# EAGLE design rgb_fb (EAGLE 6.5.0)
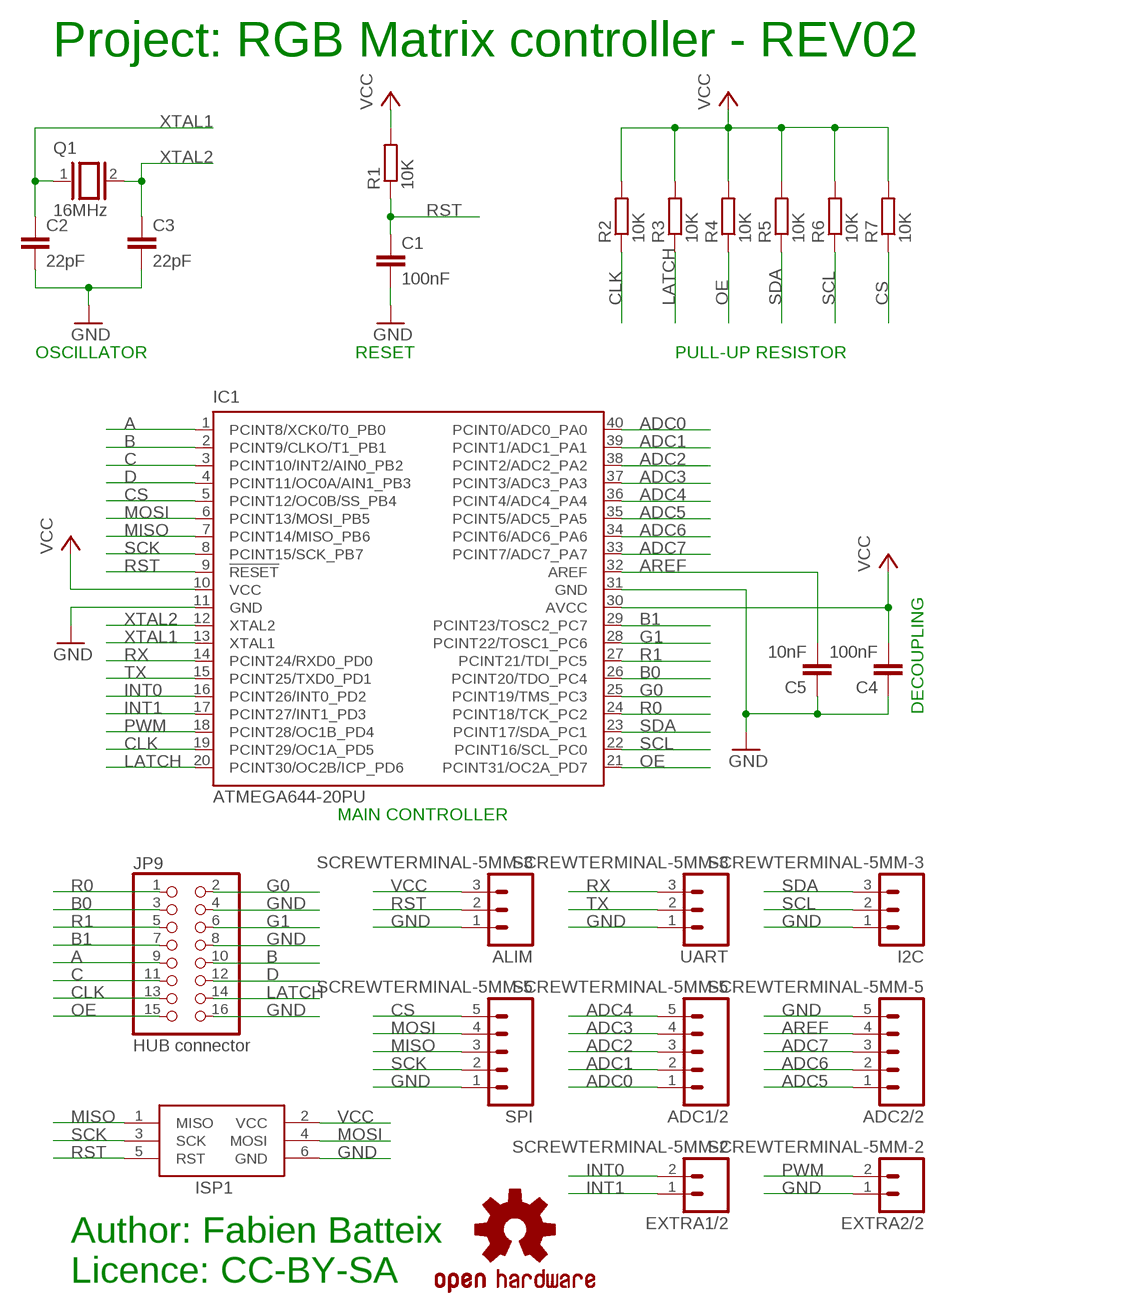
[diagram p0: schematic, sheet 1]

## Parts
ADC1/2  SCREWTERMINAL-5MM-5  [SCREWTERMINAL-5MM-5]
ADC2/2  SCREWTERMINAL-5MM-5  [SCREWTERMINAL-5MM-5]
ALIM  SCREWTERMINAL-5MM-3  [SCREWTERMINAL-5MM-3]
C1  100nF  C5/3.5  [C5B3.5]
C2  22pF  C5/3.5  [C5B3.5]
C3  22pF  C5/3.5  [C5B3.5]
C4  100nF  C5/3.5  [C5B3.5]
C5  10nF  C5/3.5  [C5B3.5]
EXTRA1/2  SCREWTERMINAL-5MM-2  [SCREWTERMINAL-5MM-2]
EXTRA2/2  SCREWTERMINAL-5MM-2  [SCREWTERMINAL-5MM-2]
I2C  SCREWTERMINAL-5MM-3  [SCREWTERMINAL-5MM-3]
IC1  ATMEGA644-20PU  [DIL40]
ISP1  AVRISP-6  [AVRISP]
JP9  HUB connector  PINHD-2X8  [2X08]
LOGO2  OSHW-LOGOL  [OSHW-LOGO-L]
Q1  16MHz  XTAL/S  [QS]
R1  10K  R-EU_0207/10  [0207/10]
R2  10K  R-EU_0207/10  [0207/10]
R3  10K  R-EU_0207/10  [0207/10]
R4  10K  R-EU_0207/10  [0207/10]
R5  10K  R-EU_0207/10  [0207/10]
R6  10K  R-EU_0207/10  [0207/10]
R7  10K  R-EU_0207/10  [0207/10]
SPI  SCREWTERMINAL-5MM-5  [SCREWTERMINAL-5MM-5]
UART  SCREWTERMINAL-5MM-3  [SCREWTERMINAL-5MM-3]

## Nets
A: IC1.1(PCINT8/XCK0/T0_PB0) JP9.9
ADC0: ADC1/2.1 IC1.40(PCINT0/ADC0_PA0)
ADC1: ADC1/2.2 IC1.39(PCINT1/ADC1_PA1)
ADC2: ADC1/2.3 IC1.38(PCINT2/ADC2_PA2)
ADC3: ADC1/2.4 IC1.37(PCINT3/ADC3_PA3)
ADC4: ADC1/2.5 IC1.36(PCINT4/ADC4_PA4)
ADC5: ADC2/2.1 IC1.35(PCINT5/ADC5_PA5)
ADC6: ADC2/2.2 IC1.34(PCINT6/ADC6_PA6)
ADC7: ADC2/2.3 IC1.33(PCINT7/ADC7_PA7)
AREF: ADC2/2.4 C5.2 IC1.32(AREF)
B: IC1.2(PCINT9/CLKO/T1_PB1) JP9.10
B0: IC1.26(PCINT20/TDO_PC4) JP9.3
B1: IC1.29(PCINT23/TOSC2_PC7) JP9.7
C: IC1.3(PCINT10/INT2/AIN0_PB2) JP9.11
CLK: IC1.19(PCINT29/OC1A_PD5) JP9.13 R2.1
CS: IC1.5(PCINT12/OC0B/SS_PB4) R7.1 SPI.5
D: IC1.4(PCINT11/OC0A/AIN1_PB3) JP9.12
G0: IC1.25(PCINT19/TMS_PC3) JP9.2
G1: IC1.28(PCINT22/TOSC1_PC6) JP9.6
GND: ADC2/2.5 ALIM.1 C1.2 C2.2 C3.2 C4.1 C5.1 EXTRA2/2.1 I2C.1 IC1.11(GND) IC1.31(GND) ISP1.6(GND) JP9.4 JP9.8 JP9.16 SPI.1 UART.1
INT0: EXTRA1/2.2 IC1.16(PCINT26/INT0_PD2)
INT1: EXTRA1/2.1 IC1.17(PCINT27/INT1_PD3)
LATCH: IC1.20(PCINT30/OC2B/ICP_PD6) JP9.14 R3.1
MISO: IC1.7(PCINT14/MISO_PB6) ISP1.1(MISO) SPI.3
MOSI: IC1.6(PCINT13/MOSI_PB5) ISP1.4(MOSI) SPI.4
OE: IC1.21(PCINT31/OC2A_PD7) JP9.15 R4.1
PWM: EXTRA2/2.2 IC1.18(PCINT28/OC1B_PD4)
R0: IC1.24(PCINT18/TCK_PC2) JP9.1
R1: IC1.27(PCINT21/TDI_PC5) JP9.5
RST: ALIM.2 C1.1 IC1.9(!RESET) ISP1.5(RST) R1.1
RX: IC1.14(PCINT24/RXD0_PD0) UART.3
SCK: IC1.8(PCINT15/SCK_PB7) ISP1.3(SCK) SPI.2
SCL: I2C.2 IC1.22(PCINT16/SCL_PC0) R6.1
SDA: I2C.3 IC1.23(PCINT17/SDA_PC1) R5.1
TX: IC1.15(PCINT25/TXD0_PD1) UART.2
VCC: ALIM.3 C4.2 IC1.10(VCC) IC1.30(AVCC) ISP1.2(VCC) R1.2 R2.2 R3.2 R4.2 R5.2 R6.2 R7.2
XTAL1: C2.1 IC1.13(XTAL1) Q1.1
XTAL2: C3.1 IC1.12(XTAL2) Q1.2

## Notes on the sheet
- Project: RGB Matrix controller - REV02
- OSCILLATOR | RESET | PULL-UP RESISTOR
- DECOUPLING
- MAIN CONTROLLER
- Author: Fabien Batteix
  Licence: CC-BY-SA

## Library data of the parts
ADC1/2 ADC2/2 SPI = skywodd:SCREWTERMINAL-5MM-5
ALIM I2C UART = skywodd:SCREWTERMINAL-5MM-3
C1-C5 = capacitor-wima:C: CAPACITOR naming: grid - package width
EXTRA1/2 EXTRA2/2 = skywodd:SCREWTERMINAL-5MM-2
IC1 = atmel:ATMEGA644-*PU: 8-bit Microcontroller with 64K Bytes In-System Programmable Flash Auto generated by make-symbol-device-package-bsdl.ulp Rev. 34 Source: http://www.atmel.com/dyn/resources/prod_documents/doc2593.pdf; MPN: ATMEGA644-20PU; OC_FARNELL: 1288340; OC_NEWARK: 23M5060
ISP1 = adafruit:AVRISP: AVR ISP HEADER Standard 6 pin header for AVR programming
JP9 = pinhead:PINHD-2X8: PIN HEADER
LOGO2 = SparkFun-Aesthetics:OSHW-LOGO: Open Source Hardware Logo This logo indicates the piece of hardware it is found on incorporates a OSHW license and/or adheres to the definition of open source hardware found here: http://freedomdefined.org/OSHW
Q1 = special:XTAL/S: CRYSTAL
R1-R7 = resistor:R-EU_: RESISTOR, European symbol

## Board
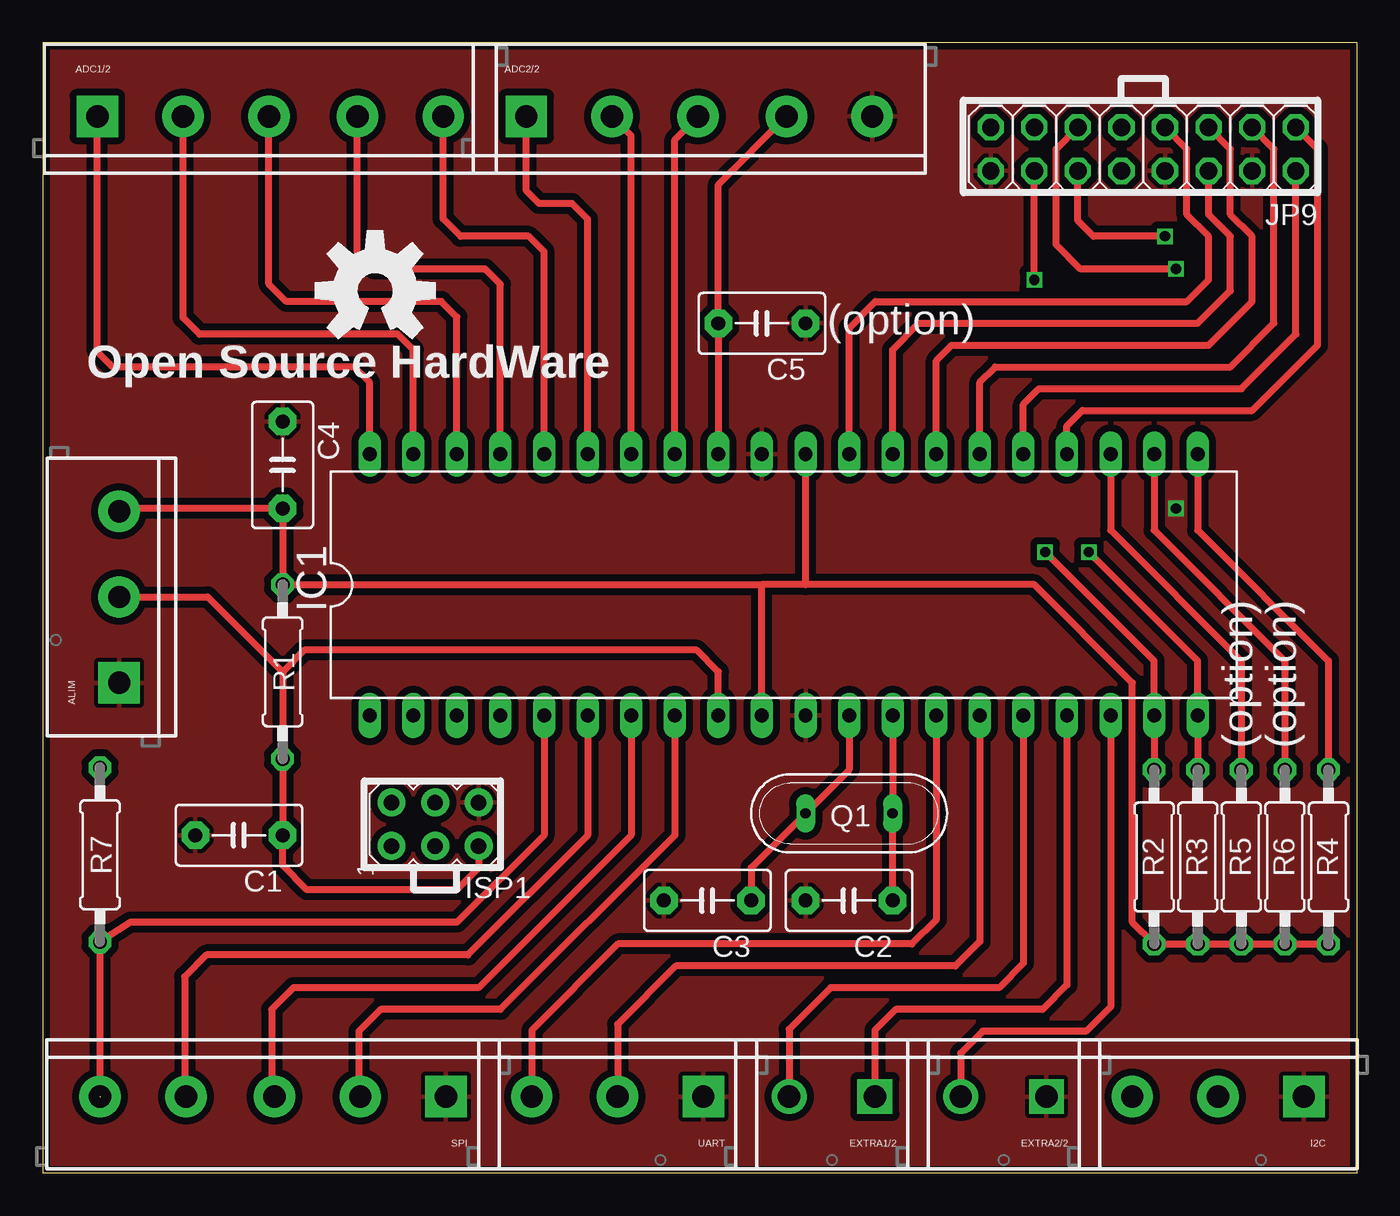
[diagram p1: board, top side]
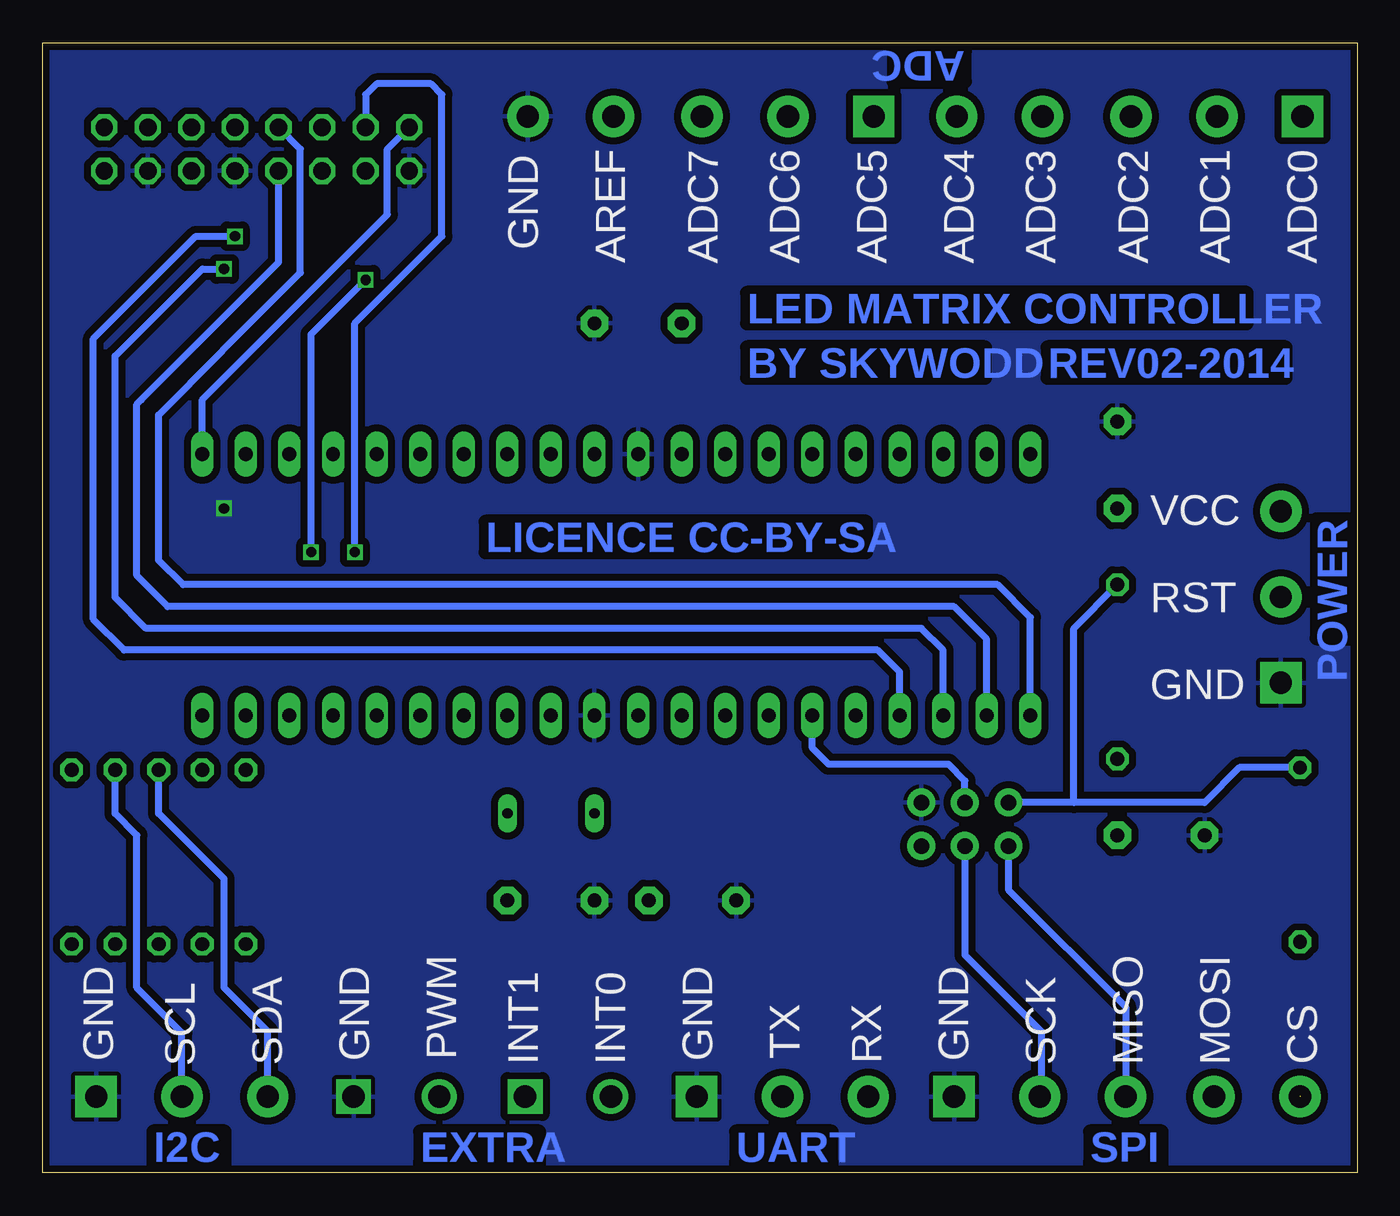
[diagram p2: board, bottom side, seen from below]

Size 76.6 x 65.89 mm. Coordinates in mm from the lower left corner, seen from the top.
Outline: 0,0 76.6,0 76.6,65.89 0,65.89 0,0
Copper layers (1*16): Top 0.035mm / dielectric 1.5mm / Bottom 0.035mm
Design rules "SeeedStudio_DRU_no_angle_2layer": minimum track width 6mil, minimum drill 12mil, track to track 6mil, track to pad 6mil, pad to pad 6mil, via to via 6mil, smd to smd 0mil, copper to edge 10mil, drill to drill 10mil, minimum pad ring 10mil, minimum via ring 6mil, stop-mask expansion 2mil, vias tented up to drill 25mil, thermal gap 10mil

### Footprints (pad centres in the part's own frame; a part is rotated, then mirrored left to right if it is on the bottom)
SCREWTERMINAL-5MM-5 = drill 1.3 pad 2.413 square: 1 -5.08,0 | drill 1.3 pad 2.413: 2 -0.08,0; 3 4.92,0; 4 10.08,0; 5 15.08,0
SCREWTERMINAL-5MM-3 = drill 1.3 pad 2.413 square: 1 0,0 | drill 1.3 pad 2.413: 2 5,0; 3 10,0
C5B3.5 = drill 0.813 pad 1.6 octagon: 1 -2.54,0; 2 2.54,0
SCREWTERMINAL-5MM-2 = drill 1.3 pad 2.032 square: 1 0,0 | drill 1.3 pad 2.032: 2 5,0
DIL40 = drill 0.813 long: 1 -24.13,-7.62; 2 -21.59,-7.62; 3 -19.05,-7.62; 4 -16.51,-7.62; 5 -13.97,-7.62; 6 -11.43,-7.62; 7 -8.89,-7.62; 8 -6.35,-7.62; 9 -3.81,-7.62; 10 -1.27,-7.62; 11 1.27,-7.62; 12 3.81,-7.62; 13 6.35,-7.62; 14 8.89,-7.62; 15 11.43,-7.62; 16 13.97,-7.62; 17 16.51,-7.62; 18 19.05,-7.62; 19 21.59,-7.62; 20 24.13,-7.62; 21 24.13,7.62; 22 21.59,7.62; 23 19.05,7.62; 24 16.51,7.62; 25 13.97,7.62; 26 11.43,7.62; 27 8.89,7.62; 28 6.35,7.62; 29 3.81,7.62; 30 1.27,7.62; 31 -1.27,7.62; 32 -3.81,7.62; 33 -6.35,7.62; 34 -8.89,7.62; 35 -11.43,7.62; 36 -13.97,7.62; 37 -16.51,7.62; 38 -19.05,7.62; 39 -21.59,7.62; 40 -24.13,7.62
AVRISP = drill 0.9 pad 1.626: 1 -1.27,2.54; 2 1.27,2.54; 3 -1.27,0; 4 1.27,0; 5 -1.27,-2.54; 6 1.27,-2.54
2X08 = drill 1.016 octagon: 1 -8.89,-1.27; 2 -8.89,1.27; 3 -6.35,-1.27; 4 -6.35,1.27; 5 -3.81,-1.27; 6 -3.81,1.27; 7 -1.27,-1.27; 8 -1.27,1.27; 9 1.27,-1.27; 10 1.27,1.27; 11 3.81,-1.27; 12 3.81,1.27; 13 6.35,-1.27; 14 6.35,1.27; 15 8.89,-1.27; 16 8.89,1.27
QS = drill 0.61 long: 1 -2.54,0; 2 2.54,0
0207/10 = drill 0.813 octagon: 1 -5.08,0; 2 5.08,0

### Placement (x,y rotation side)
ADC1/2  8.26,61.59 0 top
ADC2/2  33.26,61.59 0 top
ALIM  4.45,28.57 90 top
C1  11.43,19.68 180 top
C2  46.99,15.88 180 top
C3  38.73,15.88 180 top
C4  13.97,41.27 270 top
C5  41.91,49.53 180 top
EXTRA1/2  48.49,4.45 180 top
EXTRA2/2  58.49,4.45 180 top
I2C  73.5,4.45 180 top
IC1  43.18,34.29 0 top
ISP1  22.86,20.32 90 top
JP9  64.14,59.69 180 top
LOGO2  19.37,51.44 0 top
Q1  46.99,20.95 180 top
R1  13.97,29.21 90 top
R2  64.77,18.41 270 top
R3  67.31,18.41 270 top
R4  74.93,18.41 270 top
R5  69.85,18.41 270 top
R6  72.39,18.41 270 top
R7  3.33,18.54 90 top
SPI  18.41,4.45 180 top
UART  38.49,4.45 180 top

### Tracks (layer width: path | path; a pad name or v marks a point on that pad's centre or on a via)
A
  Bottom 0.406: IC1.1 19.05,32.38 20.95,34.29 68.43,34.29 69.85,35.71 69.85,44.19 68.95,45.09 65.19,48.9 61.59,52.49 61.59,59.69 JP9.9
ADC0
  Top 0.406: IC1.40 19.05,46.09 18.15,46.99 4.07,46.99 3.17,47.89 ADC1/2.1
ADC1
  Top 0.406: IC1.39 21.59,48 20.69,48.9 9.13,48.9 8.18,49.85 ADC1/2.2
ADC2
  Top 0.406: IC1.38 24.13,49.9 23.23,50.8 14.19,50.8 13.18,51.82 ADC1/2.3
ADC3
  Top 0.406: IC1.37 26.67,51.81 25.77,52.7 19.29,52.7 18.34,53.66 ADC1/2.4
ADC4
  Top 0.406: IC1.36 29.21,53.71 28.31,54.61 24.35,54.61 23.34,55.63 ADC1/2.5
ADC5
  Top 0.406: IC1.35 31.75,55.62 30.85,56.52 28.93,56.52 28.18,57.27 ADC2/2.1
ADC6
  Top 0.406: IC1.34 34.29,60.48 ADC2/2.2
ADC7
  Top 0.406: IC1.33 36.83,60.25 ADC2/2.3
AREF
  Top 0.406: IC1.32 C5.2 39.37,57.63 ADC2/2.4
B
  Bottom 0.406: IC1.2 21.59,31.11 23.5,33.02 69.32,33.02 71.12,34.82 71.12,44.82 70.86,45.09 65.79,50.16 62.87,53.09 JP9.10
B0
  Top 0.406: IC1.26 54.61,46.09 55.51,46.99 69.22,46.99 71.75,49.53 71.75,59.69 JP9.3
B1
  Top 0.406: IC1.29 46.99,49.27 48.52,50.8 66.67,50.8 67.94,52.07 67.94,54.61 66.67,55.88 66.67,59.69 JP9.7
C  (via drill 0.6)
  Top 0.406: v66.04,52.7 60.48,52.7 59.05,54.12 59.05,59.69 JP9.11
  Bottom 0.406: IC1.3 24.13,30.48 25.4,31.75 70.59,31.75 72.39,33.55 72.39,47.62 67.31,52.7 v66.04,52.7
CLK  (via drill 0.6)
  Top 0.406: R2.1 IC1.19 64.77,29.84 v58.42,36.2
  Bottom 0.406: v58.42,36.2 58.42,49.53 53.34,54.61 53.34,62.87 53.98,63.5 57.15,63.5 57.78,62.87 JP9.13
CS  (1 unrouted)
  Top 0.406: SPI.5 R7.1 5.11,14.61 24.13,14.61 29.21,19.68 IC1.5
D  (via drill 0.6)
  Top 0.406: v65.41,54.61 61.22,54.61 60.33,55.51 JP9.12
  Bottom 0.406: IC1.4 26.67,29.21 27.94,30.48 71.86,30.48 73.66,32.28 73.66,48.63 67.68,54.61 v65.41,54.61
G0
  Top 0.406: IC1.25 57.15,44.82 58.05,45.72 69.85,45.72 73.03,48.9 JP9.2
G1
  Top 0.406: IC1.28 49.53,48 51.06,49.53 67.31,49.53 69.22,51.44 69.22,54.61 67.94,55.88 JP9.6
GND  (via drill 0.6)
  other vias: 66.04,38.73
  pour Bottom (isolate 0.406): 0,66.04 0,0 76.83,0 76.83,66.04
  pour Top (isolate 0.406): 0,66.04 0,0 76.83,0 76.83,66.04
INT0
  Top 0.406: IC1.16 57.15,12.21 55.73,10.79 45.91,10.79 43.49,8.38 EXTRA1/2.2
INT1
  Top 0.406: IC1.17 59.69,10.95 58.27,9.53 49.71,9.53 48.49,8.31 EXTRA1/2.1
LATCH  (via drill 0.6)
  Top 0.406: R3.1 IC1.20 67.31,29.84 v60.96,36.2 | v57.78,52.07 JP9.14
  Bottom 0.406: v60.96,36.2 60.96,48.9 v57.78,52.07
MISO
  Top 0.406: IC1.7 34.29,19.68 25.4,10.79 14.61,10.79 13.34,9.53 13.34,4.61 SPI.3
  Bottom 0.406: ISP1.1 20.32,16.51 13.49,9.68 SPI.3
MOSI
  Top 0.406: IC1.6 31.75,19.68 24.77,12.7 9.53,12.7 8.26,11.43 8.26,4.53 SPI.4
  Bottom 0.406: ISP1.4 22.86,22.86 23.81,23.81 30.8,23.81 31.75,24.77 IC1.6
OE
  Top 0.406: IC1.21 67.31,37.47 74.93,29.84 R4.1
  Bottom 0.406: IC1.21 67.31,45.09 56.52,55.88 56.52,59.69 JP9.15
PWM
  Top 0.406: IC1.18 62.23,9.68 60.81,8.26 54.78,8.26 53.49,6.97 EXTRA2/2.2
R0
  Top 0.406: IC1.24 59.69,43.55 60.59,44.45 70.48,44.45 74.3,48.26 74.3,59.69 JP9.1
R1
  Top 0.406: IC1.27 52.07,47.36 52.97,48.26 67.94,48.26 70.48,50.8 70.48,54.61 69.22,55.88 69.22,59.69 JP9.5
RST
  Top 0.406: ISP1.5 25.4,17.78 24.13,16.51 15.39,16.51 13.97,17.93 C1.1 R1.1 13.97,29.21 | ALIM.2 9.61,33.58 13.97,29.21 | IC1.9 39.37,29.21 38.1,30.48 15.24,30.48 13.97,29.21
RX
  Top 0.406: IC1.14 52.07,14.76 50.65,13.34 33.52,13.34 28.5,8.31 UART.3
SCK
  Top 0.406: IC1.8 36.83,19.68 26.67,9.53 19.68,9.53 18.41,8.26 18.41,4.53 SPI.2
  Bottom 0.406: ISP1.3 22.86,12.7 18.41,8.26 18.41,4.53 SPI.2
SCL
  Top 0.406: IC1.22 64.77,37.47 72.39,29.84 R6.1
  Bottom 0.406: I2C.2 68.5,8.17 71.12,10.79 71.12,19.68 72.39,20.95 R6.1
SDA
  Top 0.406: IC1.23 62.23,37.47 69.85,29.84 R5.1
  Bottom 0.406: I2C.3 63.49,8.25 66.04,10.79 66.04,17.14 69.85,20.95 R5.1
TX
  Top 0.406: IC1.15 54.61,13.48 53.19,12.06 36.9,12.06 33.49,8.66 UART.2
VCC
  Top 0.406: R4.2 R6.2 R5.2 R3.2 R2.2 63.5,14.61 63.5,28.57 57.78,34.29 44.45,34.29 | IC1.10 41.91,34.29 | 44.45,34.29 IC1.30 | 44.45,34.29 41.91,34.29 | ALIM.3 4.61,38.73 C4.2 R1.2 41.91,34.29
  Bottom 0.406: 16.51,21.59 16.51,31.75 R1.2 | R7.2 6.86,23.62 8.89,21.59 16.51,21.59 | 16.51,21.59 ISP1.2
XTAL1
  Top 0.406: IC1.13 Q1.1 C2.1
XTAL2
  Top 0.406: IC1.12 46.99,23.5 Q1.2 41.27,17.78 C3.1

### Text on the board
Bottom: ADC | LED MATRIX CONTROLLER | REV02-2014 | BY SKYWODD | POWER | LICENCE CC-BY-SA | SPI | UART | EXTRA | I2C
tPlace: Open Source HardWare
tNames: (option) | (option) | (option)
bNames: ADC0 | ADC1 | ADC2 | ADC3 | ADC4 | ADC5 | ADC6 | ADC7 | AREF | GND | VCC | RST | GND | MOSI | MISO | PWM | GND | GND | INT0 | INT1 | GND | GND | SCK | SDA | SCL | CS | RX | TX